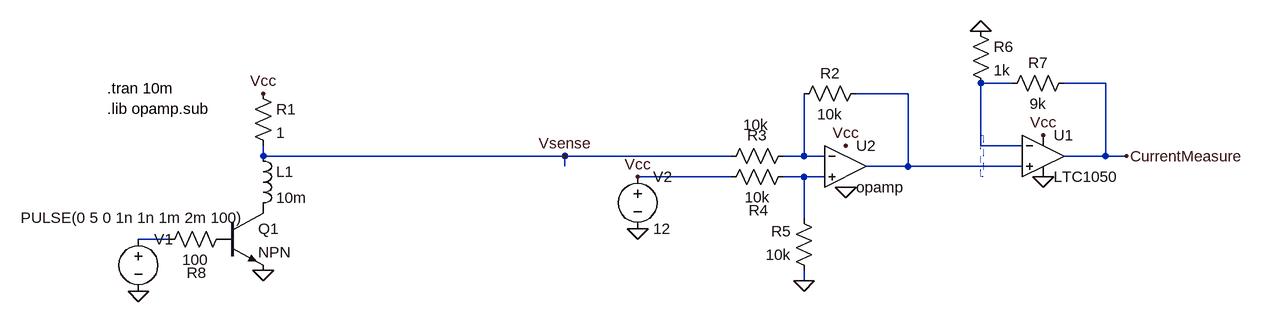
[diagram p0: schematic Draft1.asc]
Draft1.asc, the LTspice schematic file:
Version 4
SHEET 1 2068 680
WIRE 1712 240 1664 240
WIRE 1856 240 1792 240
WIRE 1552 256 1472 256
WIRE 1664 336 1664 240
WIRE 1728 336 1664 336
WIRE 560 352 560 336
WIRE 1024 352 560 352
WIRE 1280 352 1024 352
WIRE 1392 352 1392 256
WIRE 1392 352 1360 352
WIRE 1424 352 1392 352
WIRE 1856 352 1856 240
WIRE 1856 352 1792 352
WIRE 1888 352 1856 352
WIRE 1024 368 1024 352
WIRE 1552 368 1552 256
WIRE 1552 368 1488 368
WIRE 1728 368 1552 368
WIRE 1280 384 1136 384
WIRE 1392 384 1360 384
WIRE 1424 384 1392 384
WIRE 1392 448 1392 384
WIRE 416 480 368 480
WIRE 1392 544 1392 528
FLAG 560 256 Vcc
FLAG 560 528 0
FLAG 368 560 0
FLAG 1392 544 0
FLAG 1136 464 0
FLAG 1456 400 0
FLAG 1456 336 Vcc
FLAG 1136 384 Vcc
FLAG 1024 352 Vsense
FLAG 1760 384 0
FLAG 1664 160 0
FLAG 1760 320 Vcc
FLAG 1888 352 CurrentMeasure
SYMBOL res 544 240 R0
SYMATTR InstName R1
SYMATTR Value 1
SYMBOL ind 544 336 R0
SYMATTR InstName L1
SYMATTR Value 10m
SYMATTR SpiceLine Rser=23
SYMBOL npn 496 432 R0
SYMATTR InstName Q1
SYMBOL voltage 368 464 R0
WINDOW 3 -181 -17 Left 2
SYMATTR Value PULSE(0 5 0 1n 1n 1m 2m 100)
SYMATTR InstName V1
SYMBOL res 1488 240 R90
WINDOW 0 0 56 VBottom 2
WINDOW 3 32 56 VTop 2
SYMATTR InstName R2
SYMATTR Value 10k
SYMBOL res 1376 336 R90
WINDOW 0 0 56 VBottom 2
WINDOW 3 -48 58 VTop 2
SYMATTR InstName R3
SYMATTR Value 10k
SYMBOL res 1376 368 R90
WINDOW 0 83 54 VBottom 2
WINDOW 3 32 56 VTop 2
SYMATTR InstName R4
SYMATTR Value 10k
SYMBOL res 1408 544 R180
WINDOW 0 36 76 Left 2
WINDOW 3 36 40 Left 2
SYMATTR InstName R5
SYMATTR Value 10k
SYMBOL voltage 1136 368 R0
SYMATTR InstName V2
SYMATTR Value 12
SYMBOL Opamps/opamp 1456 304 R0
SYMATTR InstName U2
SYMBOL res 1648 144 R0
SYMATTR InstName R6
SYMATTR Value 1k
SYMBOL res 1808 224 R90
WINDOW 0 0 56 VBottom 2
WINDOW 3 32 56 VTop 2
SYMATTR InstName R7
SYMATTR Value 9k
SYMBOL Opamps/LTC1050 1760 288 R0
SYMATTR InstName U1
SYMBOL res 512 464 R90
WINDOW 0 83 54 VBottom 2
WINDOW 3 32 56 VTop 2
SYMATTR InstName R8
SYMATTR Value 100
TEXT 320 248 Left 2 !.tran 10m\n.lib opamp.sub
RECTANGLE Normal 1664 320 1668 384 2

The netlist it stands for:
* Draft1.asc
R1 Vcc Vsense 1
L1 Vsense P001 10m Rser=23
Q1 P001 P002 0 0 NPN
V1 N005 0 PULSE(0 5 0 1n 1n 1m 2m 100)
R2 N002 N003 10k
R3 N003 Vsense 10k
R4 N004 Vcc 10k
R5 0 N004 10k
V2 Vcc 0 12
XU2 N003 N004 N002 opamp Aol=100K GBW=10Meg  ; pins invin noninvin out
R6 0 N001 1k
R7 CurrentMeasure N001 9k
XU1 N002 N001 Vcc 0 CurrentMeasure LTC1050  ; pins In+ In- V+ V- OUT
R8 P002 N005 100
.model NPN NPN
.model PNP PNP
.lib standard.bjt
.tran 10m
.lib opamp.sub
.lib LTC.lib
.backanno
.end